# EAGLE design LDK320ADU50R 5V0 LDO breakout (EAGLE 9.3.2)
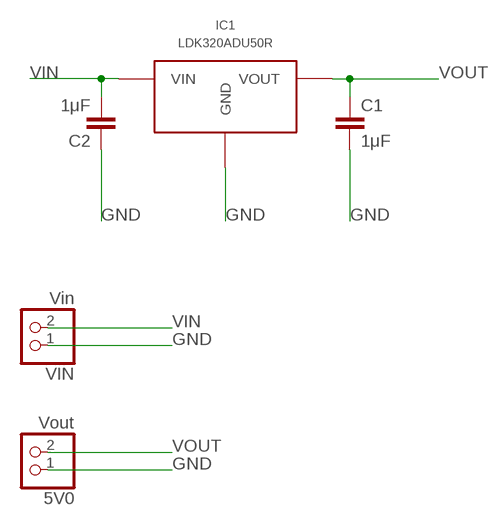
[diagram p0: schematic, sheet 1]

## Parts
5V0  Vout  PINHD-1X2  [1X02]
C1  1μF  C-EUC0402  [C0402]
C2  1μF  C-EUC0402  [C0402]
IC1  LDK320ADU50R  LDO  [SOT-89-D]
VIN  Vin  PINHD-1X2  [1X02]

## Nets
GND: 5V0.1 C1.2 C2.1 IC1.GND VIN.1
VIN: C2.2 IC1.VIN VIN.2
VOUT: 5V0.2 C1.1 IC1.VOUT

## Library data of the parts
5V0 VIN = pinhead:PINHD-1X2: PIN HEADER
C1 C2 = rcl:C-EU: CAPACITOR, European symbol; SPICEPREFIX: C
IC1 = LDO SOT-89:LDO

## Board
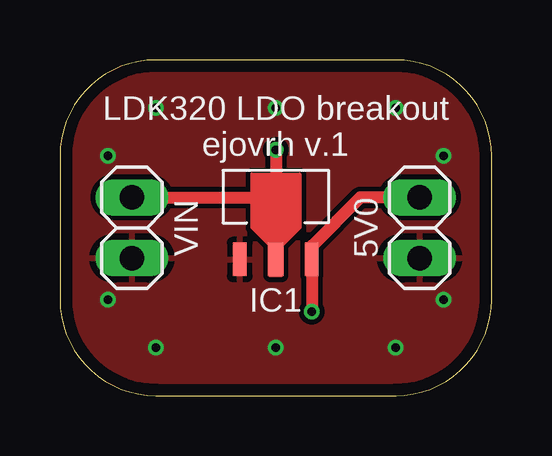
[diagram p1: board, top side]
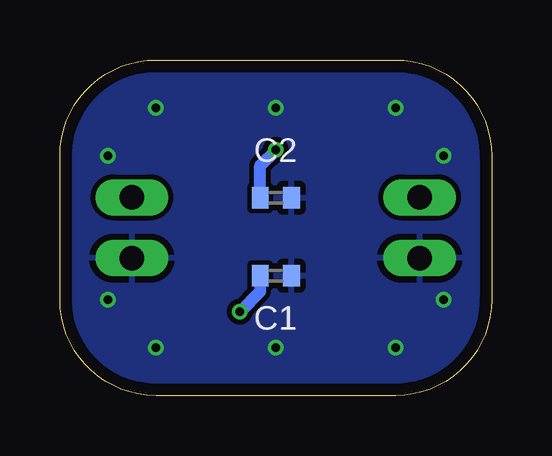
[diagram p2: board, bottom side, seen from below]

Size 18 x 14 mm. Coordinates in mm from the lower left corner, seen from the top.
Outline: 4,0 14,0 arc90 18,4 18,10 arc90 14,14 4,14 arc90 0,10 0,4 arc90 4,0
Copper layers (1*16): Top 0.035mm / dielectric 1.5mm / Bottom 0.035mm
Design rules "markovac_2layer": minimum track width 0.2mm, minimum drill 0.35mm, track to track 0.2mm, track to pad 0.2mm, pad to pad 0.2mm, via to via 0.2mm, smd to smd 0.2mm, copper to edge 0.5mm, drill to drill 8mil, minimum pad ring 0.15mm, minimum via ring 0.15mm, stop-mask expansion 4mil, vias tented up to drill 0.35mm, thermal gap 10mil

### Footprints (pad centres in the part's own frame; a part is rotated, then mirrored left to right if it is on the bottom)
1X02 = drill 1.016 long: 1 -1.27,0; 2 1.27,0
C0402 = smd 0.7 x 0.9: 1 -0.65,0; 2 0.65,0
SOT-89-D = smd 0.57 x 1.4: GND -1.5,0.685; VOUT 1.5,0.685 | smd 0.65 x 1.4: VIN 0,0.685

### Placement (x,y rotation side)
5V0  15,7 90 top
C1  9,5 0 bottom
C2  9,8.25 180 bottom
IC1  9,5 0 top
VIN  3,7 90 top

### Tracks (layer width: path | path; a pad name or v marks a point on that pad's centre or on a via)
GND  (via drill 0.35)
  other vias: 2,4 4,2 9,2 14,2 16,4 16,10 14,12 9,12 4,12 2,10
  pour Top: 0,14 18,14 18,0 0,0
  pour Bottom: 0,14 18,14 18,0 0,0
VIN  (via drill 0.35)
  Top 0.5: VIN.2 9,8.27 | v9,10.25 9,8.27 | IC1.VIN 9,8.27
  Bottom 0.5: C2.2 9.65,9.6 v9,10.25
VOUT  (via drill 0.35)
  Top 0.5: v10.5,3.5 IC1.VOUT 10.5,6.25 12.52,8.27 5V0.2
  Bottom 0.5: C1.1 9.65,4.35 v10.5,3.5

### Text on the board
tPlace: LDK320 LDO breakout / ejovrh v.1